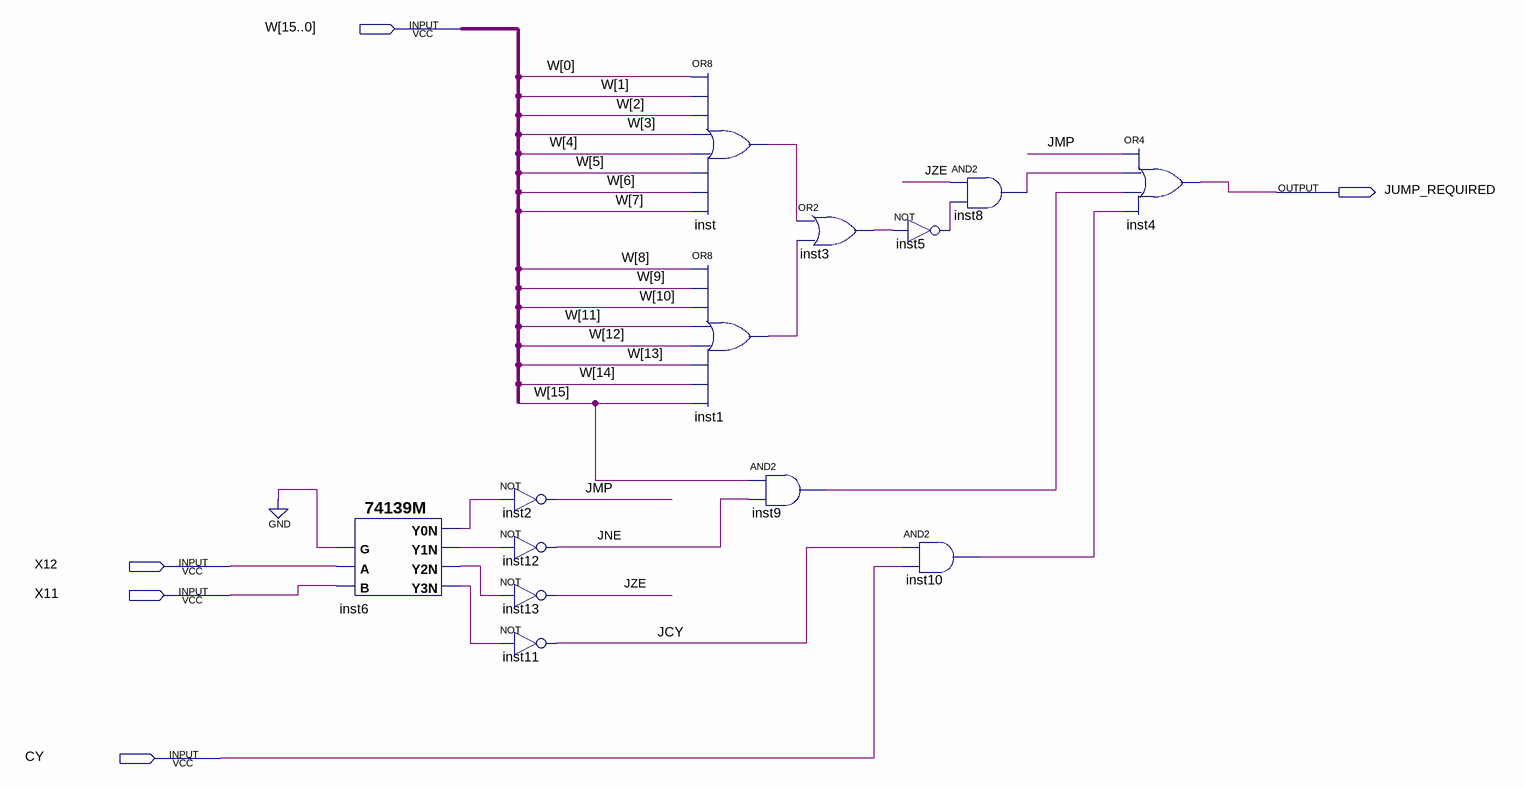
[diagram p0: schematic sheet]
// Quartus schematic ev20jumpControl.bdf as structural Verilog: 13 symbols, 5 pins
module ev20jumpControl (
  input  [15:0] W,
  input  X12,
  input  X11,
  input  CY,
  output JUMP_REQUIRED
);

  wire inst1_out, inst3_out, inst5_out, inst6_y0n, inst6_y1n, inst6_y2n, inst6_y3n, inst8_out, inst9_out,
       inst10_out, inst_out, JCY, JMP, JNE, JZE;

  \74139M  inst6 (.B(X11), .A(X12), .G(1'b0), .Y3N(inst6_y3n), .Y2N(inst6_y2n), .Y0N(inst6_y0n), .Y1N(inst6_y1n));
  not inst2 (JMP, inst6_y0n);
  not inst12 (JNE, inst6_y1n);
  not inst13 (JZE, inst6_y2n);
  not inst11 (JCY, inst6_y3n);
  or inst (inst_out, W[0], W[1], W[2], W[3], W[4], W[5], W[6], W[7]);
  or inst1 (inst1_out, W[8], W[9], W[10], W[11], W[12], W[13], W[14], W[15]);
  or inst3 (inst3_out, inst_out, inst1_out);
  and inst9 (inst9_out, W[15], JNE);
  not inst5 (inst5_out, inst3_out);
  and inst8 (inst8_out, JZE, inst5_out);
  and inst10 (inst10_out, JCY, CY);
  or inst4 (JUMP_REQUIRED, JMP, inst8_out, inst9_out, inst10_out);
endmodule
